# Altium schematic sheet Power & Connections.SchDoc
size A4
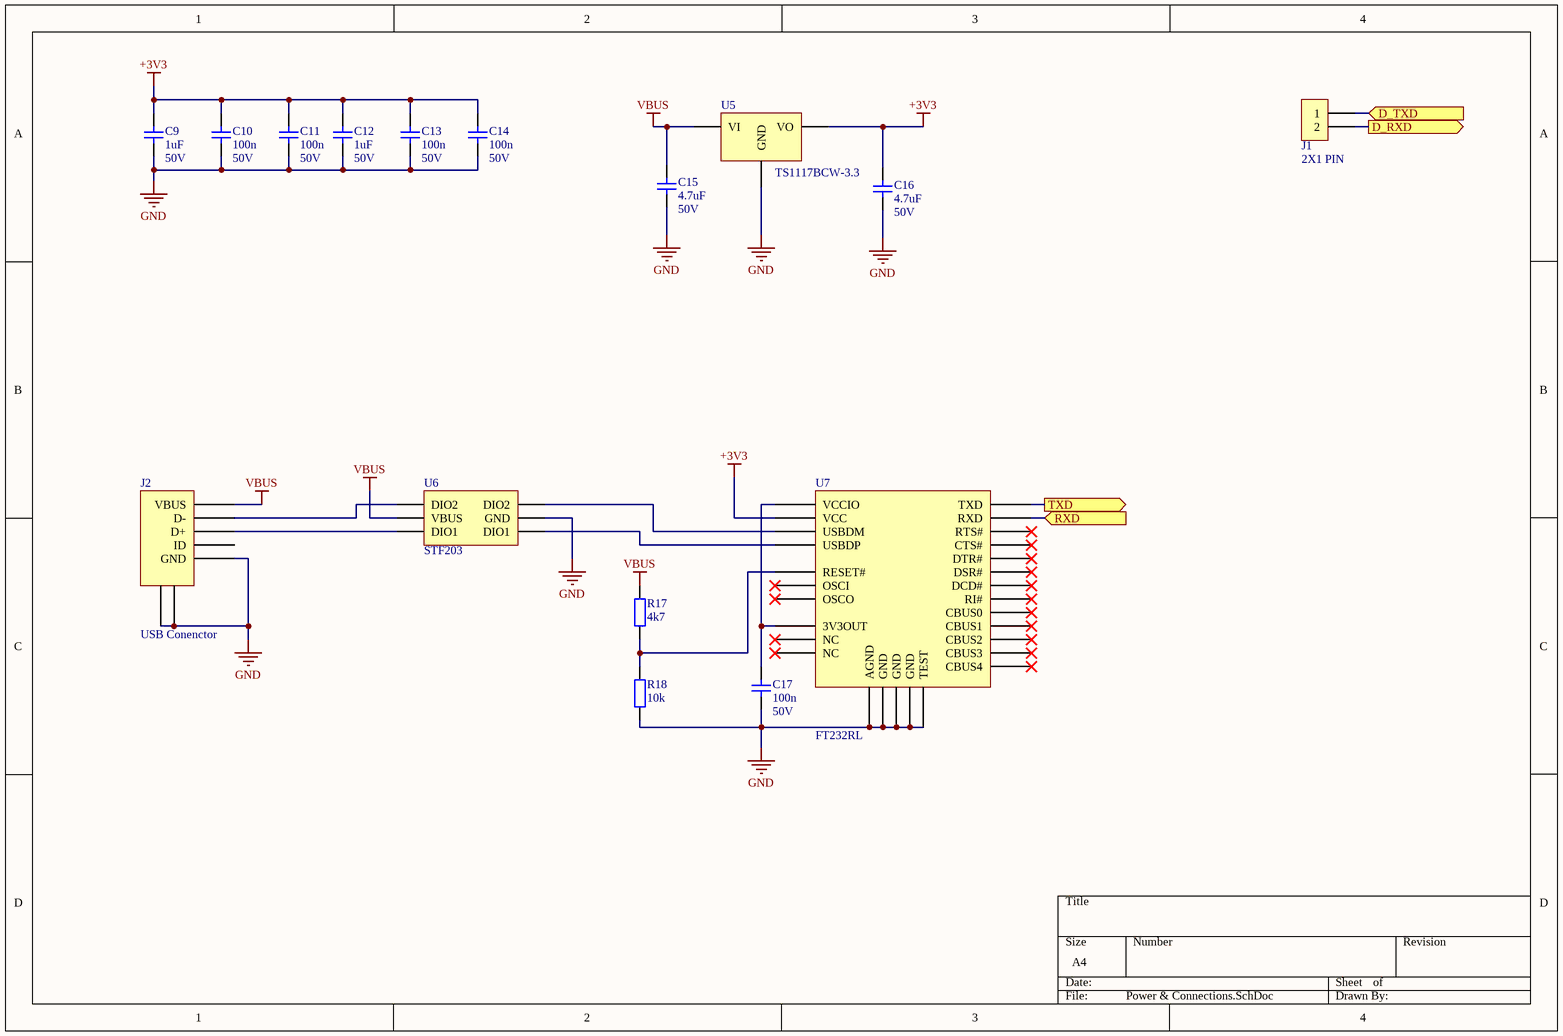
[diagram p0: Power & Connections.SchDoc]

## Parts
C9  value 1uF  Voltage Rating: 50V  [C1206]  (hidden comment: CAP)
C10  value 100n  Voltage Rating: 50V  [C1206]  (hidden comment: CAP)
C11  value 100n  Voltage Rating: 50V  [C1206]  (hidden comment: CAP)
C12  value 1uF  Voltage Rating: 50V  [C1206]  (hidden comment: CAP)
C13  value 100n  Voltage Rating: 50V  [C1206]  (hidden comment: CAP)
C14  value 100n  Voltage Rating: 50V  [C1206]  (hidden comment: CAP)
C15  value 4.7uF  Voltage Rating: 50V  [C1206]  (hidden comment: CAP)
C16  value 4.7uF  Voltage Rating: 50V  [C1206]  (hidden comment: CAP)
C17  value 100n  Voltage Rating: 50V  [C1206]  (hidden comment: CAP)
J1  2X1 PIN  [2X1PINHEAD]
J2  USB Conenctor  [USB_MINI]
R17  value 4k7  [R1206]  (hidden comment: 1206)
R18  value 10k  [R1206]  (hidden comment: 1206)
U5  TS1117BCW-3.3  [SOT-223]
U6  STF203  [SOT23-6]
U7  FT232RL  [SSOP28]

## Ports
D_RXD (out), D_TXD (in), RXD (in), TXD (out)

## Nets
+3V3: C9.1 C10.1 C11.1 C12.1 C13.1 C14.1 C16.1 U5.2(VO) U7.20(VCC)
GND: C9.2 C10.2 C11.2 C12.2 C13.2 C14.2 C15.2 C16.2 C17.2 J2.5(GND) J2.6(SHIELD) J2.7(SHIELD) R18.2 U5.1(GND) U6.2(GND) U7.7(GND) U7.18(GND) U7.21(GND) U7.25(AGND) U7.26(TEST)
VBUS: C15.1 J2.1(VBUS) R17.1 U5.3(VI) U6.5(VBUS)
D_RXD: J1.2 ; port D_RXD
D_TXD: J1.1 ; port D_TXD
RXD: U7.5(RXD) ; port RXD
TXD: U7.1(TXD) ; port TXD
NetC17_1: C17.1 U7.4(VCCIO) U7.17(3V3OUT)
NetJ2_2: J2.2(D-) U6.4(DIO2)
NetJ2_3: J2.3(D+) U6.6(DIO1)
NetR17_2: R17.2 R18.1 U7.19(RESET#)
NetU6_1: U6.1(DIO1) U7.15(USBDP)
NetU6_3: U6.3(DIO2) U7.16(USBDM)

Not connected (* = marked no-connect by the designer): J2 4(ID); U7 2(DTR#)* 3(RTS#)* 6(RI#)* 8(NC)* 9(DSR#)* 10(DCD#)* 11(CTS#)* 12(CBUS4)* 13(CBUS2)* 14(CBUS3)* 22(CBUS1)* 23(CBUS0)* 24(NC)* 27(OSCI)* 28(OSCO)*

## Library data of the parts
C9-C17 = CAP: Capacitor
J1 = 2X1 PIN: Pin Header 2x1
J2 = USB: USB connector
R17 R18 = RES: 1206 Resistor
U5 = TS1117BCW-3.3: TAIWAN SEMICONDUCTOR - TS1117BCW-3.3 - LDO VOLTAGE REG, 0.8A, 12V, SOT223-3; Supplier 1: Farnell; Manufacturer: TAIWAN SEMICONDUCTOR; Manufacturer Part Number: TS1117BCW-3.3; RoHS: YES; Stock 1: 3747; Pricing 1: 1=364,249, 10=186,762, 100=105,396, 300=94,013, 700=83,052, 2000=51,012, 7000=48,904, 20000=48,482 (EUR); ComponentLink1URL: http://www.farnell.com/datasheets/1766208.pdf; ComponentLink1Description: http://www.farnell.com/datasheets/1766208.pdf; Supplier Part Number 1: 7208359
U6 = STF203: STF203 - IC, FILTER, USB, ESD PROTECT, SOT236
U7 = FT232RL: USB-UART Bridge FTDI device; Manufacturer Part Number: FT232RL-REEL; Bridge Type: USB to UART; Supply Voltage Min: 1.8; Supply Voltage Max: 5.25; Interface Case Style: SSOP; No. of Pins: 28; SVHC: No SVHC (15-Jun-2015); Supply Voltage Range: 1.8V to 5.25V, 3.3V to 5.25V<!--FANDB--><div class="features-and-benefits-container"><div class="features-and-benefits-description"><span class="features-benefits-value">The FT232R is the latest device to be added to FTDI's range of USB UART interface Integrated Circuit Devices. The FT232R is a USB to serial UART interface with optional clock generator output, and the new FTDIChip-ID security dongle feature. In addition, asynchronous and synchronous bit bang interface modes are available. USB to serial designs using the FT232R have been further simplified by fully integrating the external EEPROM, clock circuit and USB resistors onto the device.</span></div><div class="features-and-benefits-list"><ul class="features-and-benefits-list-list"><li class="features-and-benefits-list-item">Single chip USB to asynchronous serial data transfer interface</li><li class="features-and-benefits-list-item">Entire USB protocol handled on the chip - No USB-specific firmware programming required</li><li class="features-and-benefits-list-item">UART interface support for 7 or 8 data bits, 1 or 2 stop bits & odd/even/mark/space/no parity</li><li class="features-and-benefits-list-item">Fully assisted hardware or X-On / X-Off software handshaking</li><li class="features-and-benefits-list-item">In-built support for event characters and line break condition</li><li class="features-and-benefits-list-item">New USB FTDIChip-ID feature</li><li class="features-and-benefits-list-item">New configurable CBUS I/O pins</li><li class="features-and-benefits-list-item">Auto transmit buffer control for RS485 applications</li><li class="features-and-benefits-list-item">Transmit and receive LED drive signals</li><li class="features-and-benefits-list-item">New 48MHz, 24MHz,12MHz, and 6; Supplier 1: Farnell; Manufacturer: FTDI; RoHS: YES; Stock 1: 222260; Pricing 1: 1=1260,536, 10=1163,572, 50=1108,766, 100=1049,744, 250=935,916, 500=817,873, 1000=678,75 (EUR); Operating Temperature Min: -40; Operating Temperature Max: 85; Packaging: Cut Tape; MSL: MSL 3 - 168 hours; Operating Temperature Range: -40°C to +85; ComponentLink1URL: http://www.farnell.com/datasheets/1647396.pdf; ComponentLink1Description: http://www.farnell.com/datasheets/1647396.pdf; Supplier Part Number 1: 1146032